# Altium schematic sheet Display.SchDoc
size A4; DocumentNumber: 2; SheetNumber: 2; SheetTotal: 2
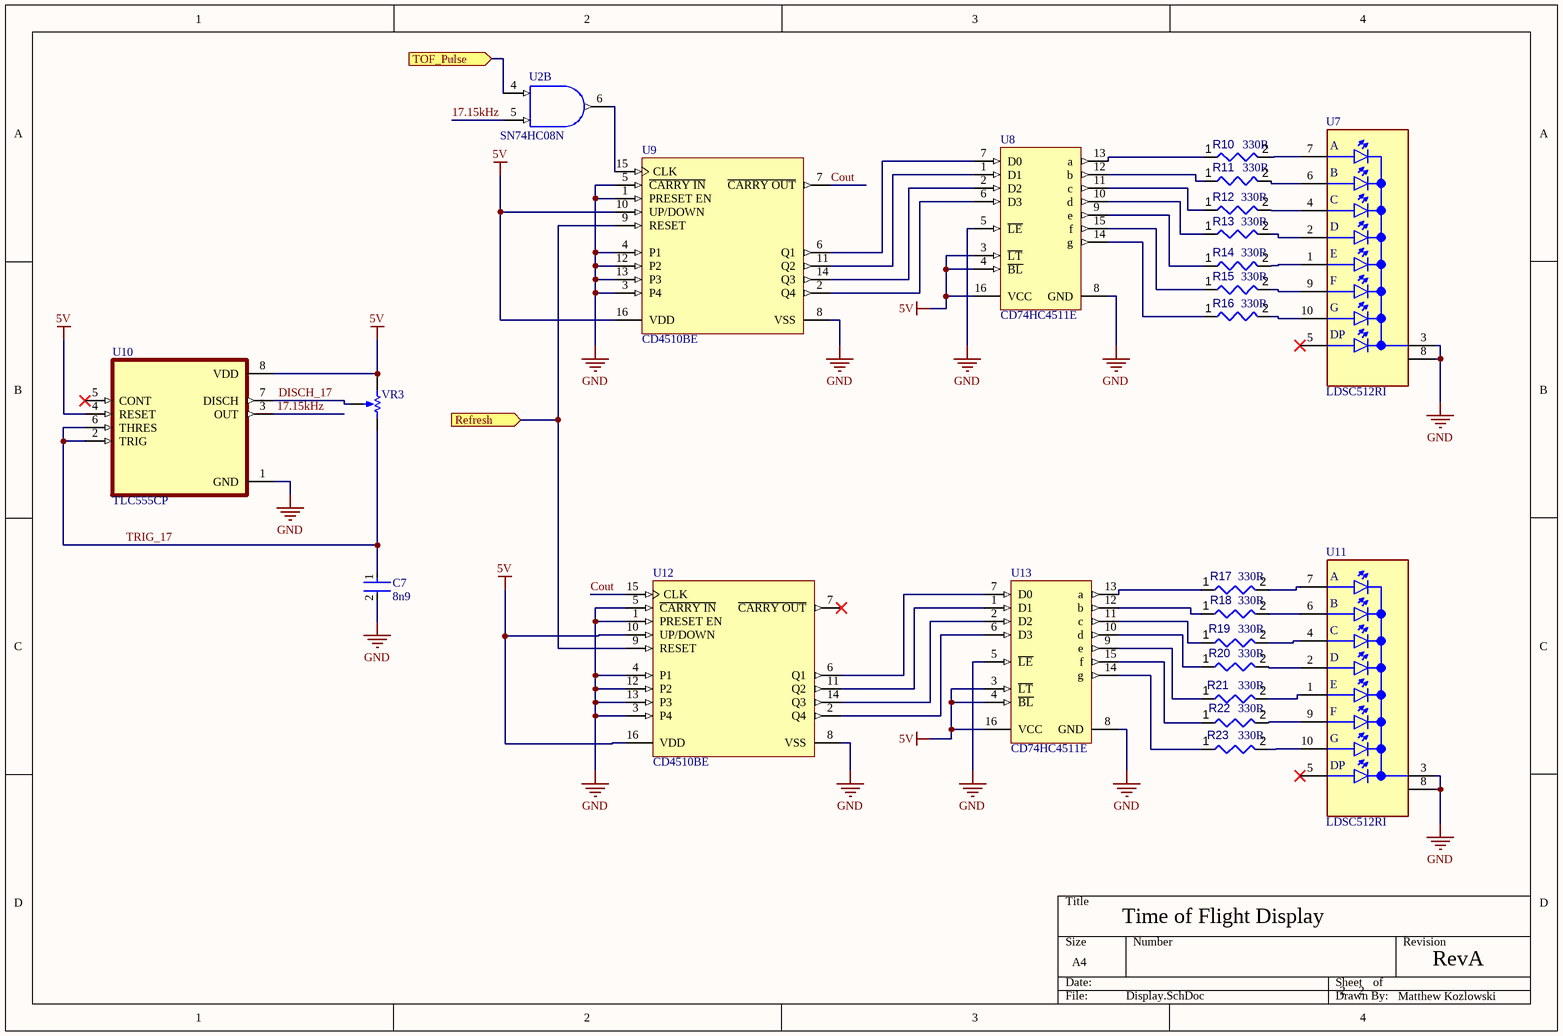
[diagram p0: Display.SchDoc]

## Parts
C7  8n9  [FP-K221K15X7RF5TL2-MFG]
R10  value 330R  [RESC0805(2012)_L]  (hidden comment: 1KR5J)
R11  value 330R  [RESC0805(2012)_L]  (hidden comment: 1KR5J)
R12  value 330R  [RESC0805(2012)_L]  (hidden comment: 1KR5J)
R13  value 330R  [RESC0805(2012)_L]  (hidden comment: 1KR5J)
R14  value 330R  [RESC0805(2012)_L]  (hidden comment: 1KR5J)
R15  value 330R  [RESC0805(2012)_L]  (hidden comment: 1KR5J)
R16  value 330R  [RESC0805(2012)_L]  (hidden comment: 1KR5J)
R17  value 330R  [RESC0805(2012)_L]  (hidden comment: 1KR5J)
R18  value 330R  [RESC0805(2012)_L]  (hidden comment: 1KR5J)
R19  value 330R  [RESC0805(2012)_L]  (hidden comment: 1KR5J)
R20  value 330R  [RESC0805(2012)_L]  (hidden comment: 1KR5J)
R21  value 330R  [RESC0805(2012)_L]  (hidden comment: 1KR5J)
R22  value 330R  [RESC0805(2012)_L]  (hidden comment: 1KR5J)
R23  value 330R  [RESC0805(2012)_L]  (hidden comment: 1KR5J)
U2  SN74HC08N  [N0014A]  (part B of 5)
U7  LDSC512RI  [LED_LDSC512RI]
U8  CD74HC4511E  [N0016A]
U9  CD4510BE  [N0016A]
U10  TLC555CP  [DIP794W45P254L959H508Q8]
U11  LDSC512RI  [LED_LDSC512RI]
U12  CD4510BE  [N0016A]
U13  CD74HC4511E  [N0016A]
VR3  3362P-1-103LF  [BOUR-3362P]  (value not drawn)

## Ports
Refresh (in, see TOF_Pulse[2A]), TOF_Pulse (in, see TOF_Pulse[2C])

## Nets
5V: U8.3(~{LT}) U8.4(~{BL}) U8.16(VCC) U9.10(UP/DOWN) U9.16(VDD) U10.4(RESET) U10.8(VDD) U12.10(UP/DOWN) U12.16(VDD) U13.3(~{LT}) U13.4(~{BL}) U13.16(VCC) VR3.1(CCW)
GND: C7.2 U7.3(CC) U7.8(CC) U8.5(~{LE}) U8.8(GND) U9.1(PRESET_EN) U9.3(P4) U9.4(P1) U9.5(~{CARRY_IN}) U9.8(VSS) U9.12(P2) U9.13(P3) U10.1(GND) U11.3(CC) U11.8(CC) U12.1(PRESET_EN) U12.3(P4) U12.4(P1) U12.5(~{CARRY_IN}) U12.8(VSS) U12.12(P2) U12.13(P3) U13.5(~{LE}) U13.8(GND)
17.15kHz: U2.5(2B) U10.3(OUT)
Cout: U9.7(~{CARRY_OUT}) U12.15(CLK)
DISCH_17: U10.7(DISCH) VR3.2(S)
Refresh: U9.9(RESET) U12.9(RESET) ; port Refresh
TOF_Pulse: U2.4(2A) ; port TOF_Pulse
TRIG_17: C7.1 U10.2(TRIG) U10.6(THRES) VR3.3(CW)
NetR10_1: R10.1 U8.13(a)
NetR10_2: R10.2 U7.7(A)
NetR11_1: R11.1 U8.12(b)
NetR11_2: R11.2 U7.6(B)
NetR12_1: R12.1 U8.11(c)
NetR12_2: R12.2 U7.4(C)
NetR13_1: R13.1 U8.10(d)
NetR13_2: R13.2 U7.2(D)
NetR14_1: R14.1 U8.9(e)
NetR14_2: R14.2 U7.1(E)
NetR15_1: R15.1 U8.15(f)
NetR15_2: R15.2 U7.9(F)
NetR16_1: R16.1 U8.14(g)
NetR16_2: R16.2 U7.10(G)
NetR17_1: R17.1 U13.13(a)
NetR17_2: R17.2 U11.7(A)
NetR18_1: R18.1 U13.12(b)
NetR18_2: R18.2 U11.6(B)
NetR19_1: R19.1 U13.11(c)
NetR19_2: R19.2 U11.4(C)
NetR20_1: R20.1 U13.10(d)
NetR20_2: R20.2 U11.2(D)
NetR21_1: R21.1 U13.9(e)
NetR21_2: R21.2 U11.1(E)
NetR22_1: R22.1 U13.15(f)
NetR22_2: R22.2 U11.9(F)
NetR23_1: R23.1 U13.14(g)
NetR23_2: R23.2 U11.10(G)
NetU2_6: U2.6(2Y) U9.15(CLK)
NetU8_1: U8.1(D1) U9.11(Q2)
NetU8_2: U8.2(D2) U9.14(Q3)
NetU8_6: U8.6(D3) U9.2(Q4)
NetU8_7: U8.7(D0) U9.6(Q1)
NetU12_2: U12.2(Q4) U13.6(D3)
NetU12_6: U12.6(Q1) U13.7(D0)
NetU12_11: U12.11(Q2) U13.1(D1)
NetU12_14: U12.14(Q3) U13.2(D2)

Not connected (* = marked no-connect by the designer): U7 5(DP)*; U10 5(CONT)*; U11 5(DP)*; U12 7(~{CARRY_OUT})*

## Notes on the sheet
- Time of Flight Display
- RevA
- 2
- Matthew Kozlowski

## Library data of the parts
C7 = CMP-00030-39474895-1: K221K15X7RF5TL2 Multilayer Ceramic Capacitor, 220 pF, 50 V, ± 10%, X7R, Radial Leaded; Voltage Rating (DC): 50V; Lead Diameter: 500µm; Lead Length: 30mm; Lead/Base Style: Straight; Capacitance: 220pF; REACH SVHC: Unknown; Tolerance: 10%; Radiation Hardening: No; Depth: 2.6mm; Packaging: Cut Tape; Dielectric Material: Ceramic; Height: 4mm; Dielectric: X7R; Thickness: 2.6mm; Max Operating Temperature: 125°C; Weight: 160.004709mg; Height - Seated (Max): 5.588mm; Length: 4mm; Min Operating Temperature: -55°C; Case/Package: Dipped; Mount: Through Hole; Width: 2.4892mm; Number of Pins: 2; Diameter: 500µm; Voltage Rating: 50V; Termination: Radial; NexarPartId: 39474895; Lead Pitch: 2.5mm; RoHS: Compliant
R10-R23 = CMP-009-00076-2: 1K 0.125W 5% 0805 (2012 Metric)  SMD; Power: 125mW; Pins: 2; Mounting Technology: SMT; Tolerance: 5%; Case/Package: 0805
U2 = CMP-0777-00250-3: Quadruple 2-Input Positive-AND Gates, N0014A, TUBE; Manufacturer: Texas Instruments; Output Type: CMOS; ICC @ Nom Voltage(Max)(mA): 0.02; tpd @ Nom Voltage(Max)(ns): 28; Voltage(Nom)(V): 5; VCC(Min)(V): 2; Technology Family: HC; F @ Nom Voltage(Max)(Mhz): 70; Rating: Catalog; Bits(#): 4; Schmitt Trigger: No; VCC(Max)(V): 6; PackageReference: N0014A; Input Type: CMOS; Generic Part Number: SN74HC08; DatasheetVersion: SCLS081F; Operating Temperature Range(C): -40 to 85
U7 U11 = CMP-065-000000-2: DISPLAY, 7 SEGMENT, 14.2MM, GREEN; LED Colour:Green; Forward Current If:10mA; Forward Voltage:2.2V; Luminous Intensity:3.5mcd; No. of Digits / Alpha:1; Character Size:14.2mm; Common Connection:Common Cathode; Product Range:-; SVHC:No SVHC (27-Jun-2018); MF: Lumex Optoelectronics; Design Item ID: LDSC512RI; MP: LDSC512RI; Source: LDSC512RI.SchLib; SnapEDA_Link: https://www.snapeda.com/parts/LDSC512RI/Lumex/view-part/?ref=snap; Pin Count: 10; Value: *; Package: DIP-10 Lumex; Component Type: Standard
U8 U13 = CMP-0388-00312-2: High Speed CMOS Logic BCD-to-7-Segment Latch / Decoder / Driver, 2 to 6 V, -55 to 125 degC, 16-pin DIP (N16), Pb-Free (RoHS); Manufacturer: Texas Instruments; Vin(Min)(V): 2; Rating: Catalog; Vin(Max)(V): 6; SubFamily: Discrete Segment LED Driver; ComponentLink3URL: http://www.ti.com/litv/pdf/mpdi002c; ComponentLink1URL: http://www.ti.com/; ComponentLink3Description: Package Specification; DatasheetVersion: SCHS279D; Mounting Technology: Through Hole; PackageVersion: 4040049/E; Eco-Plan: Pb-Free (RoHS); PartNumber: CD74HC4511E; Code_JEDEC: MS-001; PackageDescription: 16-Pin Plastic In-Line, Body 19.305 x 6.35 mm, Pitch 2.54 mm; PackageReference: N0016A; ComponentLink2Description: Datasheet; ComponentLink1Description: Manufacturer URL; ComponentLink2URL: http://www.ti.com/general/docs/lit/getliterature.tsp?genericPartNumber=CD74HC4511&fileType=pdf
U9 U12 = CMP-1623-00551-2: CMOS Presettable BCD Up/Down Counter, N0016A, TUBE; Manufacturer: Texas Instruments; Technology Family: CD4000; Bits(#): 4; tpd @ Nom Voltage(Max)(ns): 200; Inputs: 1; Output Drive (IOL/IOH)(Max)(mA): 1.5/-1.5; VCC(Max)(V): 18; VCC(Min)(V): 3; Voltage(Nom)(V): 5,10,15; Schmitt Trigger: No; F @ Nom Voltage(Max)(Mhz): 8; Rating: Catalog; ICC @ Nom Voltage(Max)(mA): 0.03; Code_JEDEC: MS-001; Type: Other; Output Type: CMOS; Operating Temperature Range(C): -55 to 125; Generic Part Number: CD4510B; PackageReference: N0016A; DatasheetVersion: SCHS071B; Input Type: CMOS; Function: Counter
U10 = CMP-007-000000-3: 2.1-MHz, 250-A, Low-Power Timer 8-PDIP 0 to 70; MF: Texas Instruments; Component Type: Standard; DigiKey-Purchase-URL: https://snapeda.com/shop?store=DigiKey&id=891867; SnapEDA_Link: https://www.snapeda.com/parts/TLC555CP/Texas%20Instruments/view-part/891867/?ref=snap; Digi-Key_Part_Number: TLC555CPW-ND; Design Item ID: TLC555CP; Source: TLC555CP.SchLib; MP: TLC555CP; Texas_Instruments-Purchase-URL: https://snapeda.com/shop?store=Texas+Instruments&id=891867; Value: *; Mouser-Purchase-URL: https://snapeda.com/shop?store=Mouser&id=891867; Pin Count: 8; Package: PDIP-8 Texas
VR3 = CMP-009-00039-2: Square Trimpot(R) Trimming Potentiometer, 10 KOhm, 300 V, -55 to 125 degC, 3-Pin THD, RoHS, Tube; Manufacturer: Bourns; Tolerance: 10%; Power: 500mW; Voltage Rating: 300V; Resistance: 10k; Packaging: Rail/Tube; Package Reference: 3326P; Manufacturer URL: http://www.bourns.com/; Composition: Potentiometer; Package Description: 3-Pin Through Hole Device, Body 6.6 x 6.99 mm, Pitch 2.54 mm; Max Operating Temperature: 125°C; Min Operating Temperature: -55°C; Datasheet Version: May-16; Lead Pitch: 2.54mm; Pins: 3; Datasheet URL: http://www.bourns.com/docs/Product-Datasheets/3362.pdf; Package Quantity: 250; Case/Package: 3326P; RoHS Compliant: True; Mounting Technology: TH